# EasyEDA Pro project TC264D核心板.epro

# Schematic TC264D核心板 copy
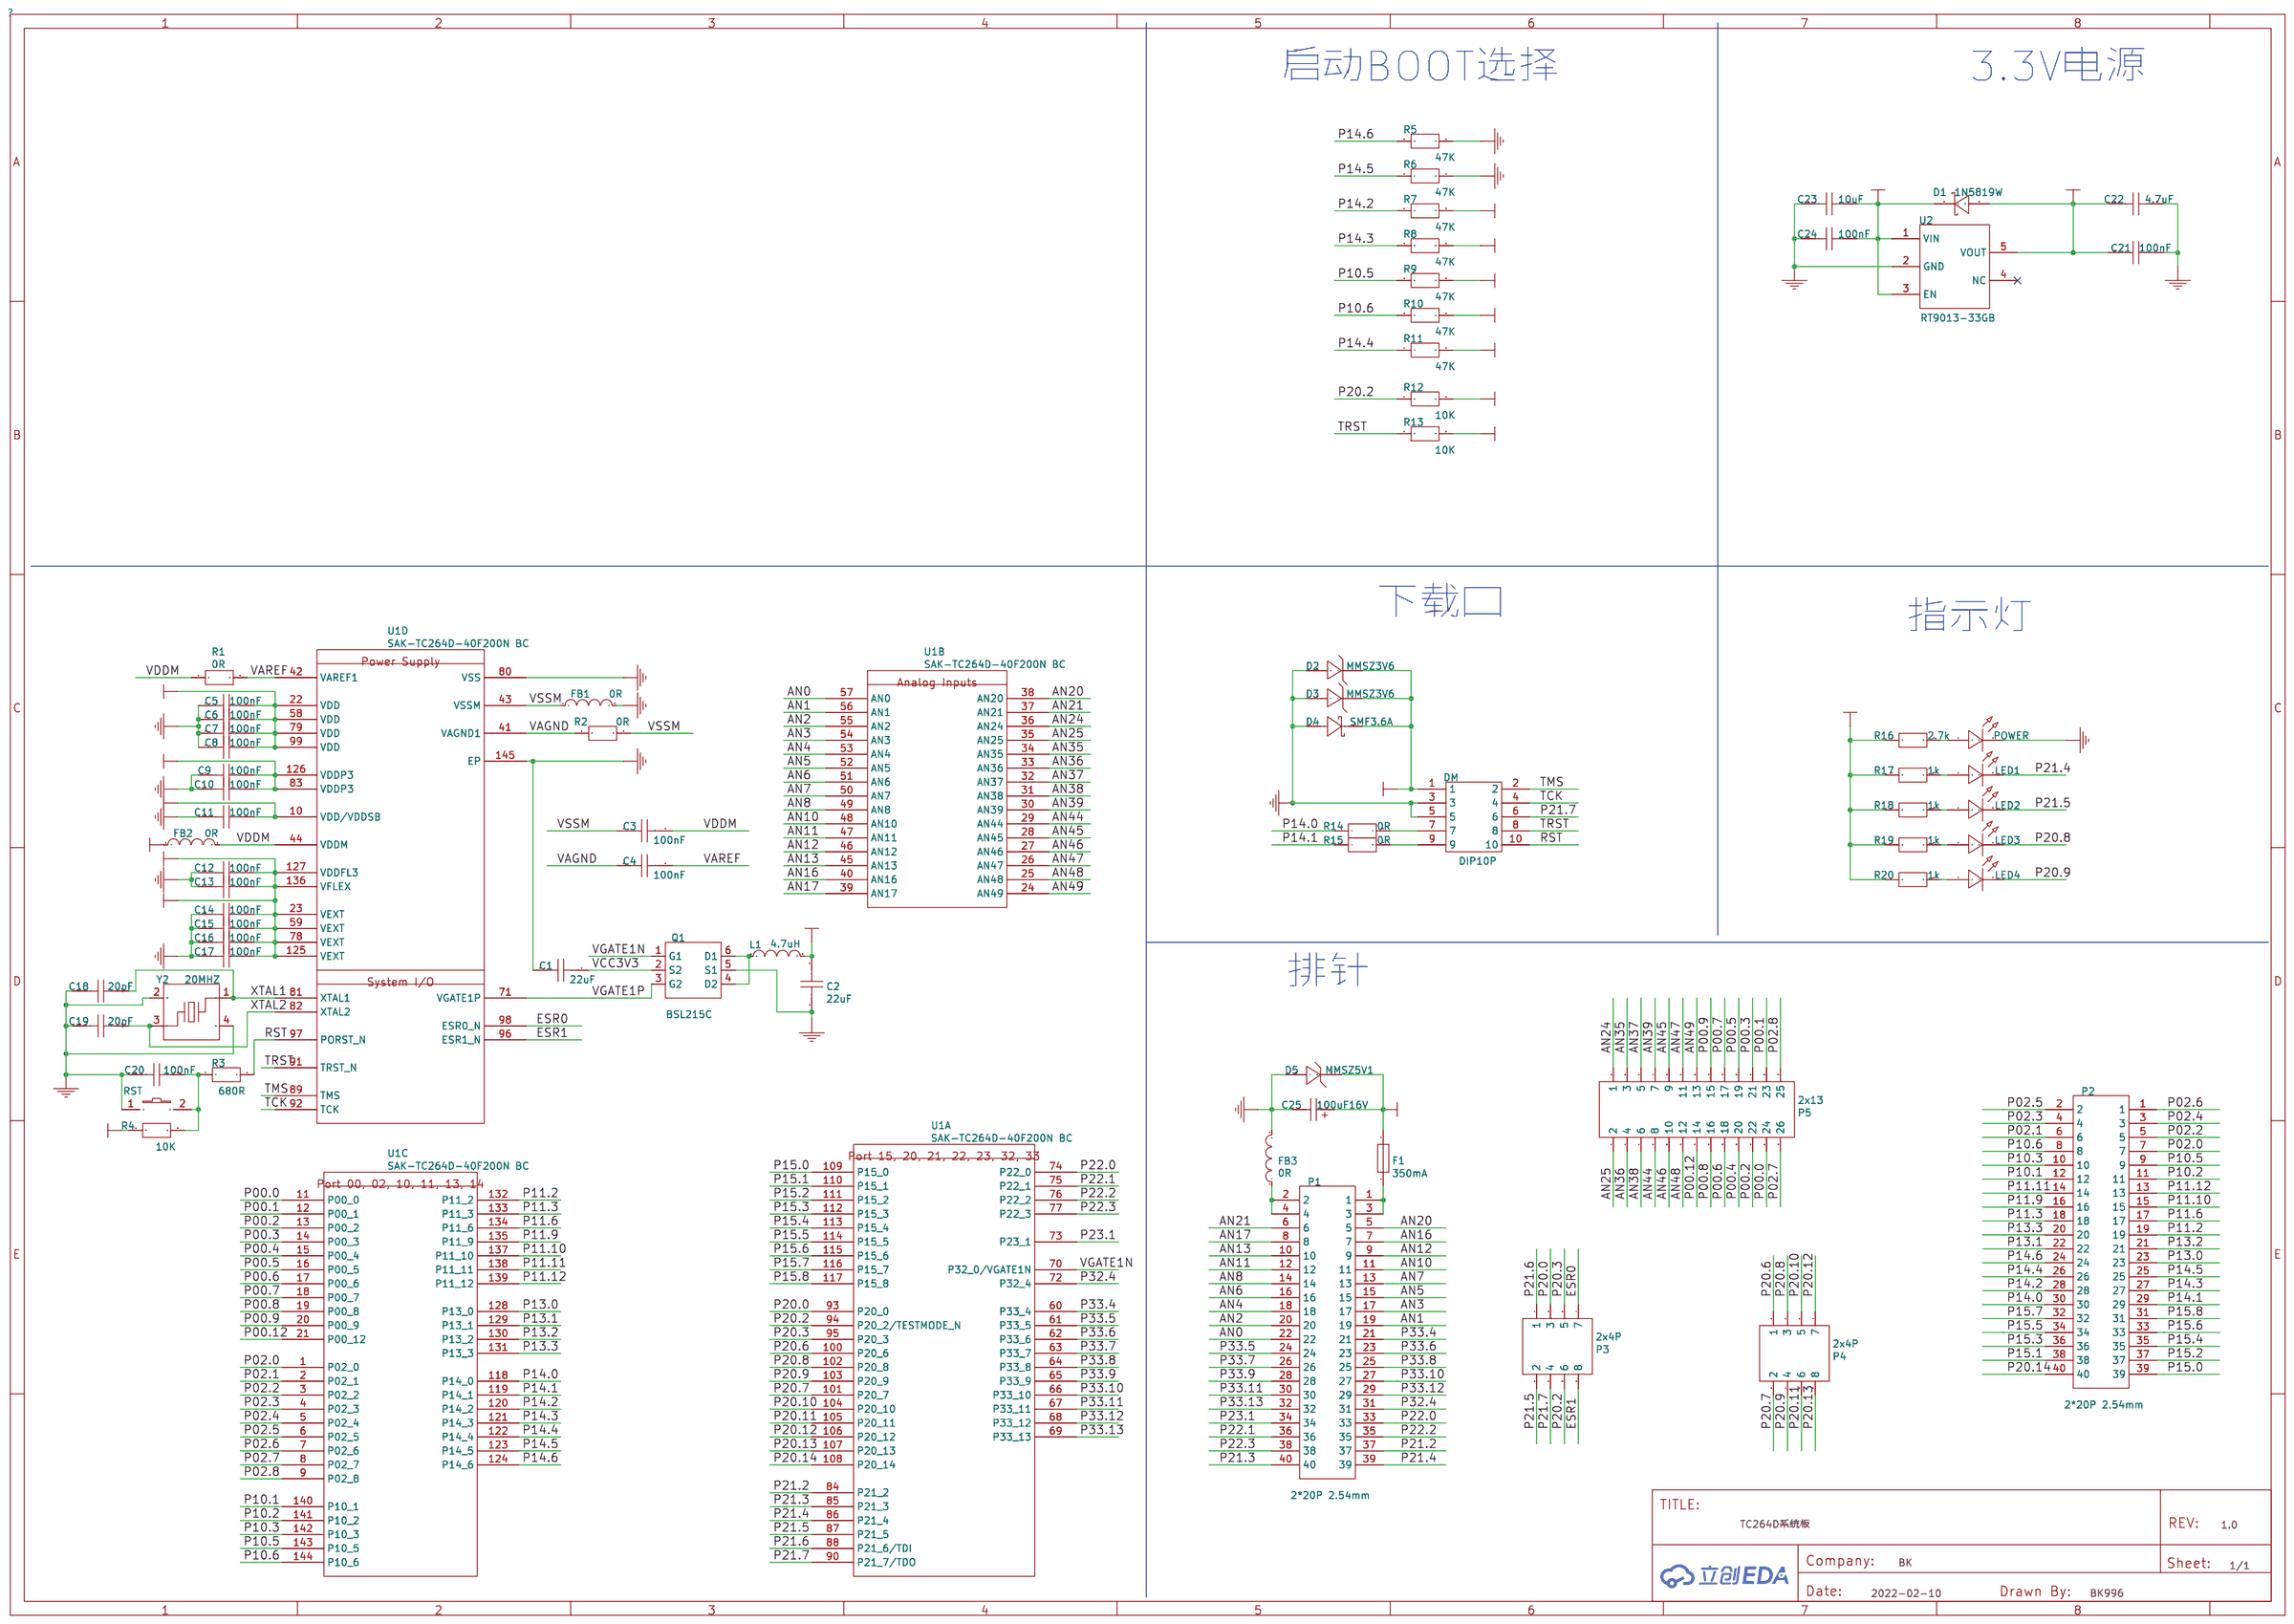
[diagram p0: schematic sheet]

## Parts
C1  22uF  [C0603]
C2  22uF  [C0603]
C3  100nF  [C0603]
C4  100nF  [C0603]
C5  100nF  [C0603]
C6  100nF  [C0603]
C7  100nF  [C0603]
C8  100nF  [C0603]
C9  100nF  [C0603]
C10  100nF  [C0603]
C11  100nF  [C0603]
C12  100nF  [C0603]
C13  100nF  [C0603]
C14  100nF  [C0603]
C15  100nF  [C0603]
C16  100nF  [C0603]
C17  100nF  [C0603]
C18  20pF  [C0603]
C19  20pF  [C0603]
C20  100nF  [C0603]
C21  100nF  [C0603]
C22  4.7uF  [C0603]
C23  10uF  [C0603]
C24  100nF  [C0603]
C25  100uF16V  [CAP-SMD_L7.3-W4.3-R-RD]
D1  1N5819W  [SOD-123F_L2.8-W1.8-LS3.7-RD]
D2  MMSZ3V6  [SOD-123_L2.6-W1.6-LS3.5-RD]
D3  MMSZ3V6  [SOD-123_L2.6-W1.6-LS3.5-RD]
D4  SMF3.6A  [SMF_L2.8-W1.8-LS3.7-FD-1]
D5  MMSZ5V1  [SOD-123_L2.7-W1.6-LS3.7-RD]
DM  DIP10P  [DIP-2X5P-2.54MM-JN]
F1  350mA  [F1206]
FB1  0R  [FB0603]
FB2  0R  [FB0603]
FB3  0R  [FB0603]
L1  4.7uH  [IND-SMD_L7.3-W6.6_MHCI06030]
LED1  LED-0603_G  [LED0603_GREEN]
LED2  LED-0603_G  [LED0603_GREEN]
LED3  LED-0603_G  [LED0603_GREEN]
LED4  LED-0603_G  [LED0603_GREEN]
P1  2*20P 2.54mm  [HDR-TH_40P-P2.54-V-F-R2-C20-S2.54]
P2  2*20P 2.54mm  [HDR-TH_40P-P2.54-V-F-R2-C20-S2.54]
P3  2x4P  [HDR-TH_8P-P2.54-V-M-R2-C4-S2.54]
P4  2x4P  [HDR-TH_8P-P2.54-V-M-R2-C4-S2.54]
P5  2x13  [HDR-TH_26P-P2.54-V-F-R2-C13-S2.54-1]
POWER  LED-0603_R  [LED0603_RED]
Q1  BSL215C  [TSOP-6_L3.0-W1.5-P0.95-LS2.8-BL]
R1  0R  [R0805]
R2  0R  [R0805]
R3  680R  [R0603]
R4  10K  [R0603]
R5  47K  [R0603]
R6  47K  [R0603]
R7  47K  [R0603]
R8  47K  [R0603]
R9  47K  [R0603]
R10  47K  [R0603]
R11  47K  [R0603]
R12  10K  [R0603]
R13  10K  [R0603]
R14  0R  [R0603]
R15  0R  [R0603]
R16  2.7k  [R0603]
R17  1k  [R0603]
R18  1k  [R0603]
R19  1k  [R0603]
R20  1k  [R0603]
RST  K2-3.6×6.1_SMD  [3*6*2.5MM轻触开关]
U1  SAK-TC264D-40F200N BC  [QFP50P2200X2200X160-145N-1]  (sections 1,2,3,4)
U2  RT9013-33GB  [SOT-23-5_L3.0-W1.7-P0.95-LS2.8-BR]
Y2  20MHZ  [CRYSTAL-SMD_4P-L3.2-W2.5-BL]

## Library data of the parts
C1 C2 = 22uF
C3-C17 C20 C21 C24 = 100nF
C18 C19 = 20pF
C22 = 4.7uF
C23 = 10uF
C25 = CA45-D-16V-100UF-K: Supplier: LCSC; Manufacturer: CEC; Supplier Part: C129274; JLCPCB Part Class: Extended Part
D1 = 1N5819W: Supplier: LCSC; Supplier Part: C169540; Manufacturer: Shandong Jingdao Microelectronics; JLCPCB Part Class: Extended Part
D2 D3 = MMSZ3V6CW: Supplier: LCSC; Supplier Part: C248749; Manufacturer: Tak Cheong; JLCPCB Part Class: Extended Part
D4 = SMF8V5A-E3-18: Supplier: LCSC; Supplier Part: C1977927; Manufacturer: VISHAY(威世); JLCPCB Part Class: Extended Part
D5 = MMSZ5V1T1G: Supplier: LCSC; Supplier Part: C132283; Manufacturer: ON Semicon; JLCPCB Part Class: Extended Part
DM = Z-2310118161010: Supplier: LCSC; Manufacturer: ZHENGLING; Supplier Part: C130109
F1 = FSMD012-1206-R: Supplier: LCSC; Supplier Part: C220144; Manufacturer: Fuzetec Tech; JLCPCB Part Class: Extended Part
FB1-FB3 = PZ2012U121-1R0TF: Supplier: LCSC; Supplier Part: C370081; Manufacturer: Sunlord; JLCPCB Part Class: Extended Part
L1 = MHCI06030-4R7M-R8: Supplier: LCSC; Manufacturer: Chilisin; Supplier Part: C108295; JLCPCB Part Class: Extended Part
LED1-LED4 = 19-217/GHC-YR1S2/3T: Manufacturer: EVERLIGHT(台湾亿光); Supplier Part: C72043; Supplier: LCSC
P1 P2 = -: Supplier: LCSC; Supplier Part: C169819; Manufacturer: Shenzhen Cankemeng; JLCPCB Part Class: Extended Part
P3 P4 = Header2X4P 2.54mm: Supplier: LCSC; Manufacturer: ReliaPro; Supplier Part: C58363; JLCPCB Part Class: Extended Part
P5 = 2×13Female header Straight line: Supplier: LCSC; Manufacturer: BOOMELE; Supplier Part: C64320; JLCPCB Part Class: Extended Part
POWER = 19-217/R6C-AL1M2VY/3T: Manufacturer: EVERLIGHT(台湾亿光); Supplier Part: C72044; Supplier: LCSC
Q1 = BSL215CH6327XTSA1: Supplier: LCSC; Manufacturer: Infineon; Supplier Part: C150914; JLCPCB Part Class: Extend
R1 R2 R14 R15 = 0R
R3 = 680R
R4 R12 R13 = 10K
R5-R11 = 47K
R16 = 2.7k
R17-R20 = 1k
RST = K2-1107ST-A4SW-06: Supplier Part: C118141; Supplier: LCSC; 制造商: 韩国韩荣
U1 = SAK-TC264D-40F200N BC: PackageReference: PG-LQFP-144-22; Manufacturer: Infineon Technologies
U2 = RT9013-33GB: Supplier: LCSC; Manufacturer: RICHTEK; Supplier Part: C47773; JLCPCB Part Class: Extended Part
Y2 = smd-3225-8Mhz: Supplier: LCSC; Supplier Part: C9900005479; Manufacturer: null; JLCPCB Part Class: Extended Part

## Nets
GNDCORE: C1.1 C2.1 C5.1 C6.1 C7.1 C8.1 C9.1 C10.1 C11.1 C12.1 C13.1 C14.1 C15.1 C16.1 C17.1 C18.1 C19.1 C20.1 C21.2 C22.2 C23.1 C24.1 C25.2 D2.2(A) D3.2(A) D4.1(A) D5.2(A) DM.3 DM.5 FB1.2 FB3.2 POWER.2 Q1.5(S1) R5.2 R6.2 RST.1 U1.80(VSS) U1.145(EP) U2.2(GND) Y2.2(GND) Y2.4(GND)
VCC: C23.2 C24.2 C25.1 D1.1 D5.1(C) F1.2 U2.1(VIN) U2.3(EN)
VCC1V3: C2.2 C5.2 C6.2 C7.2 C8.2 C11.2 L1.2 U1.10(VDD/VDDSB) U1.22(VDD) U1.58(VDD) U1.79(VDD) U1.99(VDD)
VCC3V3: C1.2 C9.2 C10.2 C12.2 C13.2 C14.2 C15.2 C16.2 C17.2 C21.1 C22.1 D1.2 D2.1(K) D3.1(K) D4.2(K) DM.1 FB2.1 Q1.2(S2) R4.1 R7.2 R8.2 R9.2 R10.2 R11.2 R12.2 R13.2 R16.1 R17.1 R18.1 R19.1 R20.1 U1.23(VEXT) U1.59(VEXT) U1.78(VEXT) U1.83(VDDP3) U1.125(VEXT) U1.126(VDDP3) U1.127(VDDFL3) U1.136(VFLEX) U2.5(VOUT)
VDDM: C3.2 FB2.2 R1.1 U1.44(VDDM)
VSSM: C3.1 FB1.1 R2.2 U1.43(VSSM)
AN0: P1.22 U1.57(AN0)
AN1: P1.19 U1.56(AN1)
AN2: P1.20 U1.55(AN2)
AN3: P1.17 U1.54(AN3)
AN4: P1.18 U1.53(AN4)
AN5: P1.15 U1.52(AN5)
AN6: P1.16 U1.51(AN6)
AN7: P1.13 U1.50(AN7)
AN8: P1.14 U1.49(AN8)
AN10: P1.11 U1.48(AN10)
AN11: P1.12 U1.47(AN11)
AN12: P1.9 U1.46(AN12)
AN13: P1.10 U1.45(AN13)
AN16: P1.7 U1.40(AN16)
AN17: P1.8 U1.39(AN17)
AN20: P1.5 U1.38(AN20)
AN21: P1.6 U1.37(AN21)
AN24: P5.1 U1.36(AN24)
AN25: P5.2 U1.35(AN25)
AN35: P5.3 U1.34(AN35)
AN36: P5.4 U1.33(AN36)
AN37: P5.5 U1.32(AN37)
AN38: P5.6 U1.31(AN38)
AN39: P5.7 U1.30(AN39)
AN44: P5.8 U1.29(AN44)
AN45: P5.9 U1.28(AN45)
AN46: P5.10 U1.27(AN46)
AN47: P5.11 U1.26(AN47)
AN48: P5.12 U1.25(AN48)
AN49: P5.13 U1.24(AN49)
ESR0: P3.7 U1.98(ESR0_N)
ESR1: P3.8 U1.96(ESR1_N)
P00.0: P5.24 U1.11(P00_0)
P00.1: P5.23 U1.12(P00_1)
P00.2: P5.22 U1.13(P00_2)
P00.3: P5.21 U1.14(P00_3)
P00.4: P5.20 U1.15(P00_4)
P00.5: P5.19 U1.16(P00_5)
P00.6: P5.18 U1.17(P00_6)
P00.7: P5.17 U1.18(P00_7)
P00.8: P5.16 U1.19(P00_8)
P00.9: P5.15 U1.20(P00_9)
P00.12: P5.14 U1.21(P00_12)
P02.0: P2.7 U1.1(P02_0)
P02.1: P2.6 U1.2(P02_1)
P02.2: P2.5 U1.3(P02_2)
P02.3: P2.4 U1.4(P02_3)
P02.4: P2.3 U1.5(P02_4)
P02.5: P2.2 U1.6(P02_5)
P02.6: P2.1 U1.7(P02_6)
P02.7: P5.26 U1.8(P02_7)
P02.8: P5.25 U1.9(P02_8)
P10.1: P2.12 U1.140(P10_1)
P10.2: P2.11 U1.141(P10_2)
P10.3: P2.10 U1.142(P10_3)
P10.5: P2.9 R9.1 U1.143(P10_5)
P10.6: P2.8 R10.1 U1.144(P10_6)
P11.2: P2.19 U1.132(P11_2)
P11.3: P2.18 U1.133(P11_3)
P11.6: P2.17 U1.134(P11_6)
P11.9: P2.16 U1.135(P11_9)
P11.10: P2.15 U1.137(P11_10)
P11.11: P2.14 U1.138(P11_11)
P11.12: P2.13 U1.139(P11_12)
P13.0: P2.23 U1.128(P13_0)
P13.1: P2.22 U1.129(P13_1)
P13.2: P2.21 U1.130(P13_2)
P13.3: P2.20 U1.131(P13_3)
P14.0: P2.30 R14.1 U1.118(P14_0)
P14.1: P2.29 R15.1 U1.119(P14_1)
P14.2: P2.28 R7.1 U1.120(P14_2)
P14.3: P2.27 R8.1 U1.121(P14_3)
P14.4: P2.26 R11.1 U1.122(P14_4)
P14.5: P2.25 R6.1 U1.123(P14_5)
P14.6: P2.24 R5.1 U1.124(P14_6)
P15.0: P2.39 U1.109(P15_0)
P15.1: P2.38 U1.110(P15_1)
P15.2: P2.37 U1.111(P15_2)
P15.3: P2.36 U1.112(P15_3)
P15.4: P2.35 U1.113(P15_4)
P15.5: P2.34 U1.114(P15_5)
P15.6: P2.33 U1.115(P15_6)
P15.7: P2.32 U1.116(P15_7)
P15.8: P2.31 U1.117(P15_8)
P20.0: P3.3 U1.93(P20_0)
P20.2: P3.6 R12.1 U1.94(P20_2/TESTMODE_N)
P20.3: P3.5 U1.95(P20_3)
P20.6: P4.1 U1.100(P20_6)
P20.7: P4.2 U1.101(P20_7)
P20.8: LED3.2 P4.3 U1.102(P20_8)
P20.9: LED4.2 P4.4 U1.103(P20_9)
P20.10: P4.5 U1.104(P20_10)
P20.11: P4.6 U1.105(P20_11)
P20.12: P4.7 U1.106(P20_12)
P20.13: P4.8 U1.107(P20_13)
P20.14: P2.40 U1.108(P20_14)
P21.2: P1.37 U1.84(P21_2)
P21.3: P1.40 U1.85(P21_3)
P21.4: LED1.2 P1.39 U1.86(P21_4)
P21.5: LED2.2 P3.2 U1.87(P21_5)
P21.6: P3.1 U1.88(P21_6/TDI)
P21.7: DM.6 P3.4 U1.90(P21_7/TDO)
P22.0: P1.33 U1.74(P22_0)
P22.1: P1.36 U1.75(P22_1)
P22.2: P1.35 U1.76(P22_2)
P22.3: P1.38 U1.77(P22_3)
P23.1: P1.34 U1.73(P23_1)
P32.4: P1.31 U1.72(P32_4)
P33.4: P1.21 U1.60(P33_4)
P33.5: P1.24 U1.61(P33_5)
P33.6: P1.23 U1.62(P33_6)
P33.7: P1.26 U1.63(P33_7)
P33.8: P1.25 U1.64(P33_8)
P33.9: P1.28 U1.65(P33_9)
P33.10: P1.27 U1.66(P33_10)
P33.11: P1.30 U1.67(P33_11)
P33.12: P1.29 U1.68(P33_12)
P33.13: P1.32 U1.69(P33_13)
RST: DM.10 R3.2 U1.97(PORST_N)
TCK: DM.4 U1.92(TCK)
TMS: DM.2 U1.89(TMS)
TRST: DM.8 R13.1 U1.91(TRST_N)
VAGND: C4.1 R2.1 U1.41(VAGND1)
VAREF: C4.2 R1.2 U1.42(VAREF1)
VGATE1N: Q1.1(G1) U1.70(P32_0/VGATE1N)
VGATE1P: Q1.3(G2) U1.71(VGATE1P)
XTAL1: C18.2 U1.81(XTAL1) Y2.1
XTAL2: C19.2 U1.82(XTAL2) Y2.3
DM_7: DM.7 R14.2
DM_9: DM.9 R15.2
P1_1: F1.1 P1.1 P1.3
P1_2: FB3.1 P1.2 P1.4
Q1_4: L1.1 Q1.4(D2) Q1.6(D1)
R3_1: C20.2 R3.1 R4.2 RST.2
R16_2: POWER.1 R16.2
R17_2: LED1.1 R17.2
R18_2: LED2.1 R18.2
R19_2: LED3.1 R19.2
R20_2: LED4.1 R20.2

Not connected (* = marked no-connect by the designer): U2 4(NC)*

## Notes on the sheet
- 启动BOOT选择
- 3.3V电源
- 下载口
- 指示灯
- 排针

# Board TC264D系统板_bk copy
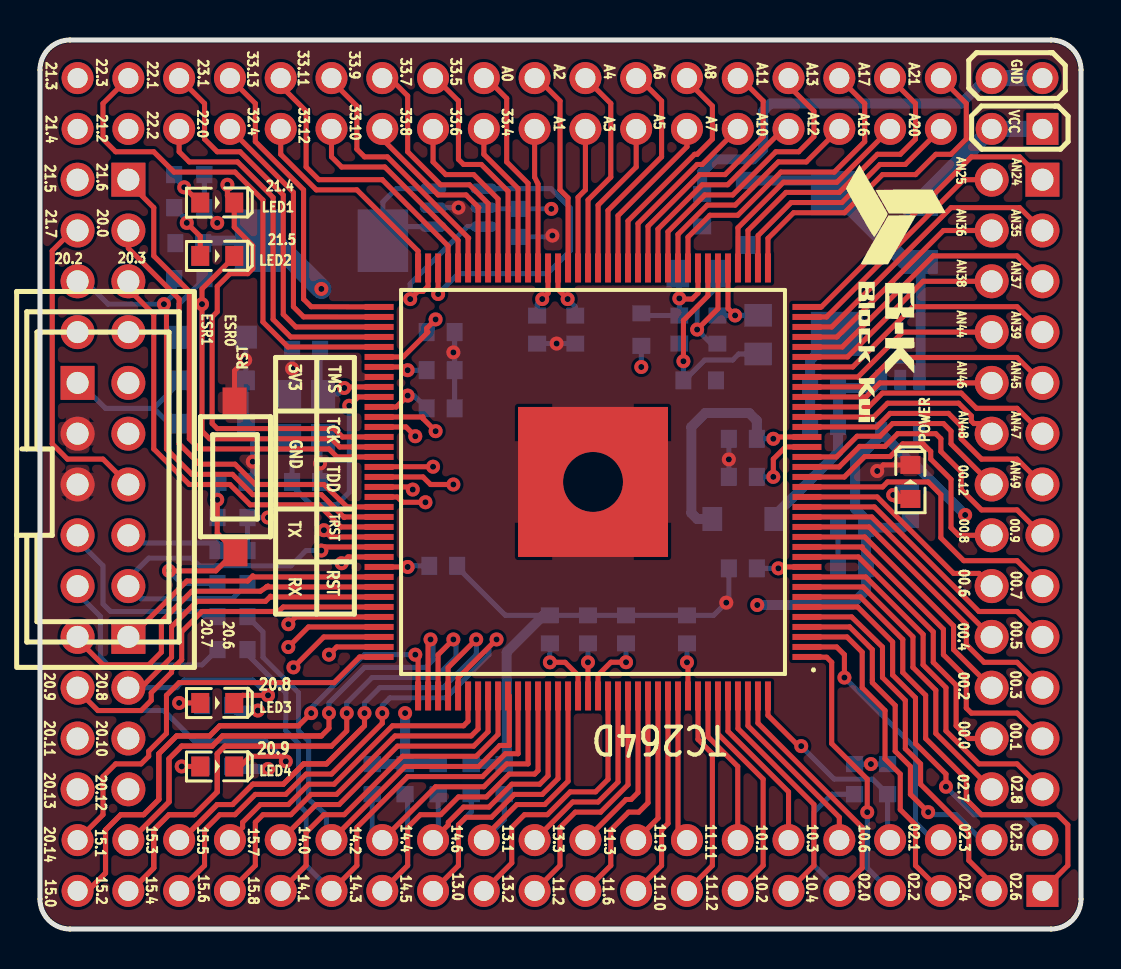
[diagram p1: board, top side]
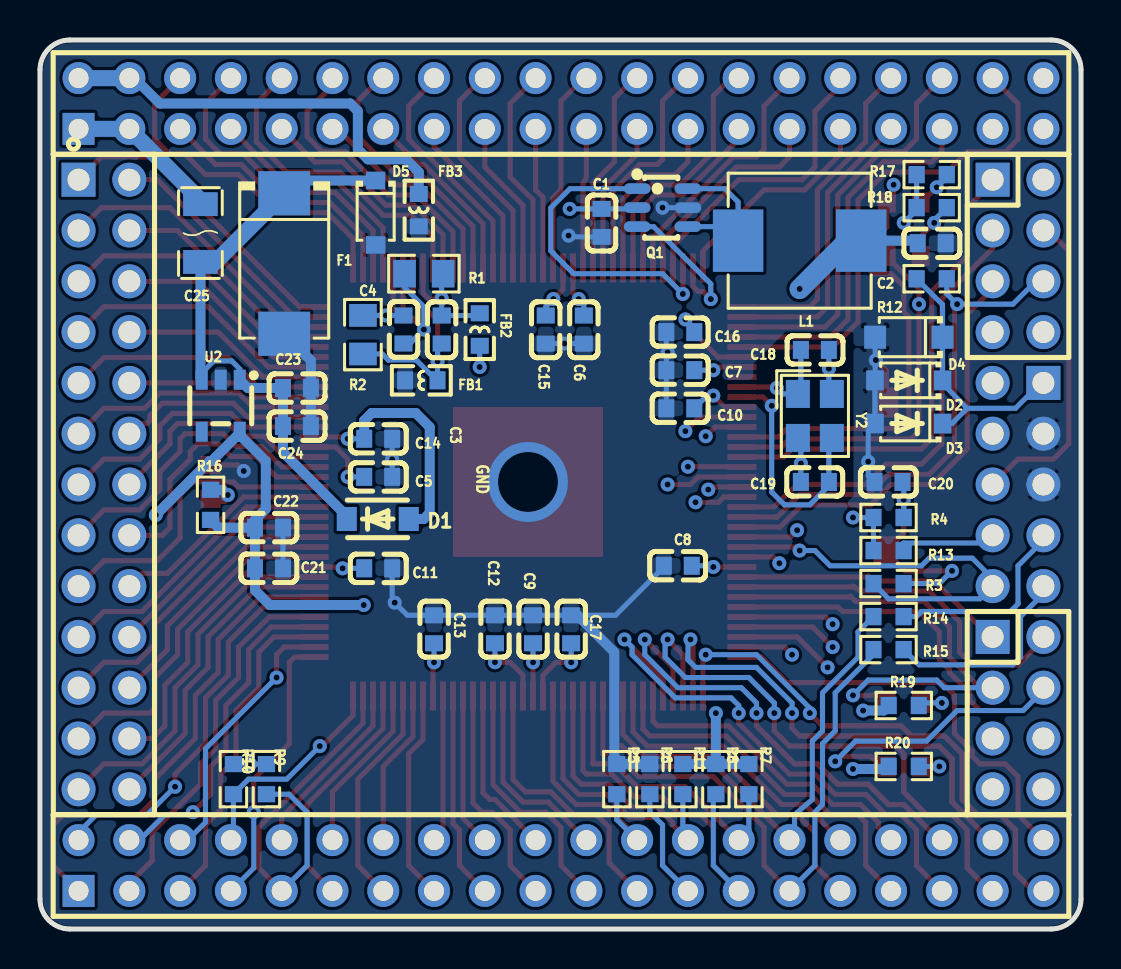
[diagram p2: board, bottom side, seen from below]

Outline 52.07 x 44.45 mm; copper layers: Top Layer, Inner1, Inner2, Bottom Layer. Coordinates in mm from the lower left corner of the outline.
Outline path: 0,42.95 arc(0.44,44.01) 1.5,44.45 50.57,44.45 arc(51.63,44.01) 52.07,42.95 52.07,1.5 arc(51.63,0.44) 50.57,0 1.5,0 arc(0.44,0.44) 0,1.5 0,42.95
Stack: Top Layer 0.035mm / Dielectric1 0.48mm PP er 4.5 / Inner1 0.035mm / Dielectric2 0.48mm FR4 er 4.5 / Inner2 0.035mm / Dielectric3 0.48mm PP er 4.5 / Bottom Layer 0.035mm

## Design rules (mm)
spacing safeClearance (default): track to track 0.152, other pairs 0.152 to 0.3
track width trackWidth (default): min 0.127, default 0.254, max 2.54
differential pair differentialPair (default): width min 0.127, default 0.254, max 2.54; gap min 0.152, default 0.152
via viaSize (default): diameter min 0.5, default 0.61, max 10; hole min 0.3, default 0.305, max 6
pour e331 uses gge18794
pour e332 uses gge23207
pour e385 uses gge21965
pour e386 uses gge23651
pour e481 uses gge23591
pour e1359 uses gge23309

## Placement (name value [footprint] x y rotation side)
C1  22uF  [C0603]  23.98 35.31 90 bottom
C2  22uF  [C0603]  7.47 34.29 0 bottom
C3  100nF  [C0603]  31.98 29.97 90 bottom
C4  100nF  [C0603]  33.88 29.97 270 bottom
C5  100nF  [C0603]  35.16 22.61 0 bottom
C6  100nF  [C0603]  26.77 29.97 90 bottom
C7  100nF  [C0603]  20.04 27.94 180 bottom
C8  100nF  [C0603]  20.17 18.16 180 bottom
C9  100nF  [C0603]  27.41 14.99 270 bottom
C10  100nF  [C0603]  20.04 26.03 180 bottom
C11  100nF  [C0603]  35.16 18.03 0 bottom
C12  100nF  [C0603]  29.31 14.99 270 bottom
C13  100nF  [C0603]  32.36 14.99 270 bottom
C14  100nF  [C0603]  35.16 24.51 0 bottom
C15  100nF  [C0603]  24.87 29.97 90 bottom
C16  100nF  [C0603]  20.04 29.84 180 bottom
C17  100nF  [C0603]  25.5 14.99 270 bottom
C18  20pF  [C0603]  13.31 28.96 0 bottom
C19  20pF  [C0603]  13.31 22.35 180 bottom
C20  100nF  [C0603]  9.63 22.35 180 bottom
C21  100nF  [C0603]  40.62 18.03 180 bottom
C22  4.7uF  [C0603]  40.62 20.07 180 bottom
C23  10uF  [C0603]  39.22 27.05 0 bottom
C24  100nF  [C0603]  39.22 25.15 0 bottom
C25  100uF16V  [CAP-SMD_L7.3-W4.3-R-RD]  39.85 33.27 90 bottom
D1  1N5819W  [SOD-123F_L2.8-W1.8-LS3.7-RD]  35.18 20.5 180 bottom
D2  MMSZ3V6  [SOD-123_L2.6-W1.6-LS3.5-RD]  8.61 27.43 0 bottom
D3  MMSZ3V6  [SOD-123_L2.6-W1.6-LS3.5-RD]  8.61 25.27 0 bottom
D4  SMF3.6A  [SMF_L2.8-W1.8-LS3.7-FD-1]  8.61 29.59 180 bottom
D5  MMSZ5V1  [SOD-123_L2.7-W1.6-LS3.7-RD]  35.28 35.81 270 bottom
DM  DIP10P  [DIP-2X5P-2.54MM-JN]  3.15 18.42 270 top
F1  350mA  [F1206]  44.04 34.8 270 bottom
FB1  0R  [FB0603]  33 27.43 0 bottom
FB2  0R  [FB0603]  30.07 29.97 90 bottom
FB3  0R  [FB0603]  33.12 35.94 270 bottom
L1  4.7uH  [IND-SMD_L7.3-W6.6_MHCI06030]  14.07 34.42 180 bottom
LED1  LED-0603_G  [LED0603_GREEN]  8.87 36.32 0 top
LED2  LED-0603_G  [LED0603_GREEN]  8.87 33.65 0 top
LED3  LED-0603_G  [LED0603_GREEN]  8.87 11.3 0 top
LED4  LED-0603_G  [LED0603_GREEN]  8.87 8.13 0 top
P1  2*20P 2.54mm  [HDR-TH_40P-P2.54-V-F-R2-C20-S2.54]  26.01 41.28 180 bottom
P2  2*20P 2.54mm  [HDR-TH_40P-P2.54-V-F-R2-C20-S2.54]  26.01 3.17 180 bottom
P3  2x4P  [HDR-TH_8P-P2.54-V-M-R2-C4-S2.54]  3.15 33.66 270 bottom
P4  2x4P  [HDR-TH_8P-P2.54-V-M-R2-C4-S2.54]  3.15 10.8 270 bottom
P5  2x13  [HDR-TH_26P-P2.54-V-F-R2-C13-S2.54-1]  48.87 22.22 270 bottom
POWER  LED-0603_R  [LED0603_RED]  43.54 22.35 90 top
Q1  BSL215C  [TSOP-6_L3.0-W1.5-P0.95-LS2.8-BL]  20.93 36.07 270 bottom
R1  0R  [R0805]  32.87 32.77 0 bottom
R2  0R  [R0805]  35.92 29.72 270 bottom
R3  680R  [R0603]  9.63 17.27 0 bottom
R4  10K  [R0603]  9.63 20.57 180 bottom
R5  47K  [R0603]  23.22 7.49 90 bottom
R6  47K  [R0603]  21.57 7.49 90 bottom
R7  47K  [R0603]  16.61 7.49 90 bottom
R8  47K  [R0603]  18.26 7.49 90 bottom
R9  47K  [R0603]  40.74 7.49 90 bottom
R10  47K  [R0603]  42.39 7.49 90 bottom
R11  47K  [R0603]  19.91 7.49 90 bottom
R12  10K  [R0603]  7.47 32.51 0 bottom
R13  10K  [R0603]  9.63 18.92 0 bottom
R14  0R  [R0603]  9.63 15.62 180 bottom
R15  0R  [R0603]  9.63 13.97 180 bottom
R16  2.7k  [R0603]  43.54 21.21 90 bottom
R17  1k  [R0603]  7.47 37.72 180 bottom
R18  1k  [R0603]  7.47 36.07 180 bottom
R19  1k  [R0603]  8.87 11.18 180 bottom
R20  1k  [R0603]  8.87 8.13 180 bottom
RST  K2-3.6×6.1_SMD  [3*6*2.5MM轻触开关]  9.75 22.61 270 top
U1  SAK-TC264D-40F200N BC  [QFP50P2200X2200X160-145N-1]  27.66 22.35 180 top
U2  RT9013-33GB  [SOT-23-5_L3.0-W1.7-P0.95-LS2.8-BR]  43.03 26.16 90 bottom
Y2  20MHZ  [CRYSTAL-SMD_4P-L3.2-W2.5-BL]  13.31 25.65 270 bottom

## Footprints (pads in the part's own frame, mm; a bottom-side part is the same pattern mirrored in y, then rotated)
3*6*2.5MM轻触开关
  custom 1.5x1.2 smd: 1(-3.72,-0.021) 2(3.72,0.021)
C0603
  rect 0.8x0.9 smd: 1(-0.7,0) 2(0.7,0)
CAP-SMD_L7.3-W4.3-R-RD
  rect 2.208x2.592 smd: 1(3.511,0) 2(-3.511,0)
CRYSTAL-SMD_4P-L3.2-W2.5-BL
  rect 1.4x1.2 smd: 1(-1.1,-0.85) 2(1.1,-0.85) 3(1.1,0.85) 4(-1.1,0.85)
DIP-2X5P-2.54MM-JN
  rect 1.7x1.7 hole 1.1: 1(-8.89,-1.27)
  round 1.7 hole 1.1: 2(-8.89,1.27) 3(-6.35,-1.27) 4(-6.35,1.27) 5(-3.81,-1.27) 6(-3.81,1.27) 7(-1.27,-1.27) 8(-1.27,1.27) 9(1.27,-1.27) 10(1.27,1.27)
F1206
  rect 1.19x1.728 smd: 1(-1.445,0) 2(1.445,0)
FB0603
  rect 0.8x0.9 smd: 1(-0.813,0) 2(0.813,0)
HDR-TH_8P-P2.54-V-M-R2-C4-S2.54
  rect 1.7x1.7 hole 1.1: 1(-3.81,-1.27)
  round 1.7 hole 1.1: 2(-3.81,1.27) 3(-1.27,-1.27) 4(-1.27,1.27) 5(1.27,-1.27) 6(1.27,1.27) 7(3.81,-1.27) 8(3.81,1.27)
HDR-TH_26P-P2.54-V-F-R2-C13-S2.54-1
  rect 1.7x1.7 hole 1.1: 1(-15.24,-1.27)
  round 1.7 hole 1.1: 2(-15.24,1.27) 3(-12.7,-1.27) 4(-12.7,1.27) 5(-10.16,-1.27) 6(-10.16,1.27) 7(-7.62,-1.27) 8(-7.62,1.27) 9(-5.08,-1.27) 10(-5.08,1.27) 11(-2.54,-1.27) 12(-2.54,1.27) 13(0,-1.27) 14(0,1.27) 15(2.54,-1.27) 16(2.54,1.27) 17(5.08,-1.27) 18(5.08,1.27) 19(7.62,-1.27) 20(7.62,1.27) 21(10.16,-1.27) 22(10.16,1.27) 23(12.7,-1.27) 24(12.7,1.27) 25(15.24,-1.27) 26(15.24,1.27)
HDR-TH_40P-P2.54-V-F-R2-C20-S2.54
  rect 1.6x1.6 hole 1: 1(-24.13,-1.27)
  round 1.6 hole 1: 2(-24.13,1.27) 3(-21.59,-1.27) 4(-21.59,1.27) 5(-19.05,-1.27) 6(-19.05,1.27) 7(-16.51,-1.27) 8(-16.51,1.27) 9(-13.97,-1.27) 10(-13.97,1.27) 11(-11.43,-1.27) 12(-11.43,1.27) 13(-8.89,-1.27) 14(-8.89,1.27) 15(-6.35,-1.27) 16(-6.35,1.27) 17(-3.81,-1.27) 18(-3.81,1.27) 19(-1.27,-1.27) 20(-1.27,1.27) 21(1.27,-1.27) 22(1.27,1.27) 23(3.81,-1.27) 24(3.81,1.27) 25(6.35,-1.27) 26(6.35,1.27) 27(8.89,-1.27) 28(8.89,1.27) 29(11.43,-1.27) 30(11.43,1.27) 31(13.97,-1.27) 32(13.97,1.27) 33(16.51,-1.27) 34(16.51,1.27) 35(19.05,-1.27) 36(19.05,1.27) 37(21.59,-1.27) 38(21.59,1.27) 39(24.13,-1.27) 40(24.13,1.27)
IND-SMD_L7.3-W6.6_MHCI06030
  rect 2.524x3.12 smd: 1(-3.078,0) 2(3.078,0)
LED0603_GREEN
  rect 0.9x1 smd: 1(-0.85,0) 2(0.85,0)
LED0603_RED
  rect 0.9x1 smd: 1(-0.85,0) 2(0.85,0)
QFP50P2200X2200X160-145N-1
  rect 1.45x0.3 smd: 1(-10.7,8.75) 2(-10.7,8.25) 3(-10.7,7.75) 4(-10.7,7.25) 5(-10.7,6.75) 6(-10.7,6.25) 7(-10.7,5.75) 8(-10.7,5.25) 9(-10.7,4.75) 10(-10.7,4.25) 11(-10.7,3.75) 12(-10.7,3.25) 13(-10.7,2.75) 14(-10.7,2.25) 15(-10.7,1.75) 16(-10.7,1.25) 17(-10.7,0.75) 18(-10.7,0.25) 19(-10.7,-0.25) 20(-10.7,-0.75) 21(-10.7,-1.25) 22(-10.7,-1.75) 23(-10.7,-2.25) 24(-10.7,-2.75) 25(-10.7,-3.25) 26(-10.7,-3.75) 27(-10.7,-4.25) 28(-10.7,-4.75) 29(-10.7,-5.25) 30(-10.7,-5.75) 31(-10.7,-6.25) 32(-10.7,-6.75) 33(-10.7,-7.25) 34(-10.7,-7.75) 35(-10.7,-8.25) 36(-10.7,-8.75) 73(10.7,-8.75) 74(10.7,-8.25) 75(10.7,-7.75) 76(10.7,-7.25) 77(10.7,-6.75) 78(10.7,-6.25) 79(10.7,-5.75) 80(10.7,-5.25) 81(10.7,-4.75) 82(10.7,-4.25) 83(10.7,-3.75) 84(10.7,-3.25) 85(10.7,-2.75) 86(10.7,-2.25) 87(10.7,-1.75) 88(10.7,-1.25) 89(10.7,-0.75) 90(10.7,-0.25) 91(10.7,0.25) 92(10.7,0.75) 93(10.7,1.25) 94(10.7,1.75) 95(10.7,2.25) 96(10.7,2.75) 97(10.7,3.25) 98(10.7,3.75) 99(10.7,4.25) 100(10.7,4.75) 101(10.7,5.25) 102(10.7,5.75) 103(10.7,6.25) 104(10.7,6.75) 105(10.7,7.25) 106(10.7,7.75) 107(10.7,8.25) 108(10.7,8.75)
  rect 0.3x1.45 smd: 37(-8.75,-10.7) 38(-8.25,-10.7) 39(-7.75,-10.7) 40(-7.25,-10.7) 41(-6.75,-10.7) 42(-6.25,-10.7) 43(-5.75,-10.7) 44(-5.25,-10.7) 45(-4.75,-10.7) 46(-4.25,-10.7) 47(-3.75,-10.7) 48(-3.25,-10.7) 49(-2.75,-10.7) 50(-2.25,-10.7) 51(-1.75,-10.7) 52(-1.25,-10.7) 53(-0.75,-10.7) 54(-0.25,-10.7) 55(0.25,-10.7) 56(0.75,-10.7) 57(1.25,-10.7) 58(1.75,-10.7) 59(2.25,-10.7) 60(2.75,-10.7) 61(3.25,-10.7) 62(3.75,-10.7) 63(4.25,-10.7) 64(4.75,-10.7) 65(5.25,-10.7) 66(5.75,-10.7) 67(6.25,-10.7) 68(6.75,-10.7) 69(7.25,-10.7) 70(7.75,-10.7) 71(8.25,-10.7) 72(8.75,-10.7) 109(8.75,10.7) 110(8.25,10.7) 111(7.75,10.7) 112(7.25,10.7) 113(6.75,10.7) 114(6.25,10.7) 115(5.75,10.7) 116(5.25,10.7) 117(4.75,10.7) 118(4.25,10.7) 119(3.75,10.7) 120(3.25,10.7) 121(2.75,10.7) 122(2.25,10.7) 123(1.75,10.7) 124(1.25,10.7) 125(0.75,10.7) 126(0.25,10.7) 127(-0.25,10.7) 128(-0.75,10.7) 129(-1.25,10.7) 130(-1.75,10.7) 131(-2.25,10.7) 132(-2.75,10.7) 133(-3.25,10.7) 134(-3.75,10.7) 135(-4.25,10.7) 136(-4.75,10.7) 137(-5.25,10.7) 138(-5.75,10.7) 139(-6.25,10.7) 140(-6.75,10.7) 141(-7.25,10.7) 142(-7.75,10.7) 143(-8.25,10.7) 144(-8.75,10.7)
  rect 7.5x7.5 smd: 145(0,0)
R0603
  rect 0.806x0.864 smd: 1(-0.753,0) 2(0.753,0)
R0805
  rect 1.133x1.377 smd: 1(-0.966,0) 2(0.966,0)
SMF_L2.8-W1.8-LS3.7-FD-1
  rect 1.1x1.15 smd: 1(-1.685,0) 2(1.685,0)
SOD-123_L2.6-W1.6-LS3.5-RD
  rect 0.88x0.99 smd: 1(-1.692,0) 2(1.692,0)
SOD-123_L2.7-W1.6-LS3.7-RD
  rect 0.88x0.96 smd: 1(-1.61,0) 2(1.61,0)
SOD-123F_L2.8-W1.8-LS3.7-RD
  rect 1x1.2 smd: 1(-1.55,0) 2(1.55,0)
SOT-23-5_L3.0-W1.7-P0.95-LS2.8-BR
  rect 1x0.6 smd: 1(1.3,-0.95) 2(1.3,0) 3(1.3,0.95) 4(-1.3,0.95) 5(-1.3,-0.95)
TSOP-6_L3.0-W1.5-P0.95-LS2.8-BL
  oval 0.532x1.336 smd: 1(-0.95,-1.268) 2(0,-1.268) 3(0.95,-1.268) 4(0.95,1.268) 5(0,1.268) 6(-0.95,1.268)

## Nets
As in the schematic.

Pads without a net: U2 4

## Via types
v1: diameter 0.7, hole 0.305, Top Layer to Bottom Layer, 83 vias
v2: diameter 4, hole 3, Top Layer to Bottom Layer, 1 via

## Routing (per net, layer and track width the routed paths; a pad name or vN(x,y) marks a point on that pad's centre or on a via; arc(x,y) is an arc through that point)
GNDCORE: length 61.6
  Top Layer w0.254: RST.1 9.73,27.92 v1(10.26,28.45) ; POWER.2 42.18,23.2 v1(41.88,22.9)
  Bottom Layer w0.254: C16.1 20.74,28.89 v1(20.68,28.83) 20.74,28.76 C10.1 ; Y2.2 14.01,24.4 v1(14.01,23.28) C19.1 ; Y2.4 12.61,26.9 v1(12.61,28.02) C18.1 ; C8.1 20.87,18.1 23.28,15.69 C17.1 C13.1 33.7,15.69 v1(34.33,16.32) 34.46,16.44 C11.1 ; D4.1 D2.2 D3.2 10.64,24.93 v1(10.64,23.37) 10.64,22.67 10.33,22.35 ; C5.1 v1(34.46,23.48) C14.1 ; C22.2 C21.2 ; C15.1 v1(25.84,29.27) C6.1 ; v1(25.63,34.67) 25.56,34.61 C1.1 ; Q1.5 v1(20.93,36.07)
  Bottom Layer w0.5: 22.43,8.25 23.34,8.25 23.34,13.84 25.19,15.69 25.5,15.69 ; C25.2 38.52,28.43 C23.1 C24.1 ; R6.2 R5.2
  vias: v2(27.66,22.35)
VCC: length 29.8
  Bottom Layer w0.254: U2.1 42.08,28 42.48,28.4 43.38,28.4 43.98,27.8 U2.3
  Bottom Layer w0.5: C25.1 39.22,37.42 D5.1 ; D1.1 36.73,20.65 39.92,23.84 39.92,27.05 41.67,27.05 U2.1 ; U2.3 44.04,27.53 44.04,33.35
  Bottom Layer w0.8: 44.04,33.35 43.29,33.35 C25.1
VCC1V3: length 80.1
  Top Layer w0.254: v1(26.39,31.5) 25.91,31.98 U1.58 ; v1(36.68,22.61) 36.68,23.5 37.29,24.1 U1.22 ; U1.10 37,18.1 v1(36.93,18.03) ; U1.99 v1(18.39,18.1) ; U1.79 18.23,28.1 v1(18.39,27.94)
  Inner1 w0.254: v1(36.68,22.61) 36.68,18.29 v1(36.93,18.03)
  Inner1 w0.5: v1(14.07,32) 14.33,32 v1(18.39,27.94) ; v1(36.93,18.03) 36.68,18.29 v1(36.68,22.61) 36.57,22.5 33.48,22.5 28.04,27.94 v1(18.39,27.94) ; v1(18.39,27.94) 19.24,27.94 21.48,25.7 21.48,20 19.58,18.1 v1(18.39,18.1) ; v1(18.39,27.94) 20.65,30.2 25.58,30.2 26.39,31.02 v1(26.39,31.5)
  Bottom Layer w0.254: v1(18.39,18.1) 18.45,18.16 19.47,18.16 ; v1(26.39,31.5) 26.77,31.11 C6.2 ; C7.2 v1(18.39,27.94) ; C11.2 v1(36.93,18.03) ; C5.2 v1(36.68,22.61)
  Bottom Layer w0.5: L1.2 8.3,34.42 8.17,34.29
  Bottom Layer w1.016: v1(14.07,32) 11.66,34.42 L1.2
VCC3V3: length 92.4
  Top Layer w0.254: v1(32.36,13.33) 32.41,13.28 U1.136 ; 29.31,13.34 28.55,13.34 27.91,12.7 U1.127 ; 19.41,29.84 18.16,28.6 U1.78 ; U1.59 25.41,31.79 v1(25.12,31.5) ; v1(36.68,24.51) 36.77,24.6 U1.23 ; U1.125 26.91,12.69 26.26,13.33 v1(25.5,13.33) ; v1(19.79,30.48) 19.34,30.03 C16.2 ; U1.83 17.82,26.1 v1(18.39,26.67) ; v1(27.41,13.33) U1.126
  Bottom Layer w0.254: v1(8.87,35.31) 8.22,35.95 R18.1 R17.1 ; C12.2 29.31,13.21 ; C9.2 v1(27.41,13.33) ; C10.2 18.71,26.67 v1(18.39,26.67) ; 5.69,26.03 3.28,26.03 2.01,27.31 DM.1 ; 5.69,26.03 6.92,27.26 D2.1 D4.2 6.93,31.22 R12.2 ; 5.69,26.03 6.45,25.27 D3.1 ; v1(25.58,36.01) C1.2 22.01,36.01 21.95,36.07 ; FB2.1 v1(30.08,28.1) ; R10.2 v1(41.56,8.25) R9.2 ; v1(11.41,20.57) R4.1 R13.2 ; C17.2 v1(25.5,13.33) ; C16.2 19.34,30.03 v1(19.79,30.48) ; v1(25.12,31.5) 24.87,31.24 C15.2 ; C13.2 v1(32.36,13.33) ; C14.2 v1(36.68,24.51)
  Bottom Layer w0.5: v1(11.41,8) 9.75,8 R20.1 ; R8.2 v1(18.26,10.8) ; C14.2 35.85,25.42 35.48,25.8 33.28,25.8 32.58,25.1 32.58,20.8 32.88,20.5 D1.2 ; R7.2 R11.2 ; v1(46.28,20.7) 43.58,23.4 43.48,23.4 42.08,24.8 U2.5 42.08,24.7 40.78,23.4 40.78,21 41.32,20.46 C22.1 ; C22.1 43.15,20.07 R16.1 ; C22.1 C21.1 41.32,16.94 40.58,16.2 v1(35.88,16.2) ; R19.1 9.87,10.92 v1(10.9,10.92)
  vias: v1(29.31,13.34)
VDDM: length 6.4
  Top Layer w0.254: U1.44 32.91,31.79 32.62,31.5 32.01,31.5 v1(31.98,31.53)
  Bottom Layer w0.254: FB2.2 30.19,30.67 C3.2 v1(31.98,31.53) 31.98,32.69 R1.1
VSSM: length 11.4
  Top Layer w0.254: v1(32.18,28.39) 32.18,30.43 33.41,31.66 U1.43
  Bottom Layer w0.254: C3.1 32.18,29.07 v1(32.18,28.39) FB1.1 32.23,27.43 33.25,28.45 34.65,28.45 34.95,28.75 R2.2
AN0: length 10.3
  Top Layer w0.254: U1.57 26.41,36.56 26.01,36.96 26.01,41.4 24.87,42.55 P1.22
AN1: length 7.1
  Top Layer w0.254: U1.56 26.91,36.59 27.28,36.96 27.28,40
AN2: length 10.5
  Top Layer w0.254: U1.55 27.41,36.45 28.55,37.59 28.55,41.28 P1.20
AN3: length 7.6
  Top Layer w0.254: 27.92,33.15 27.92,36.19 29.82,38.1 29.82,40
AN4: length 11.2
  Top Layer w0.254: P1.18 29.95,42.55 31.09,41.4 31.09,38.61 28.41,35.93 U1.53
AN5: length 8.4
  Top Layer w0.254: 32.36,40 32.36,39.12 28.91,35.67 U1.52
AN6: length 11.8
  Top Layer w0.254: U1.51 29.41,35.41 32.74,38.73 32.87,38.73 33.63,39.5 33.63,41.15 32.36,42.42 P1.16
AN7: length 9.2
  Top Layer w0.254: 34.9,40 33.12,38.23 32.87,38.23 29.91,35.27 U1.50
AN8: length 13.2
  Top Layer w0.254: P1.14 35.03,42.55 36.17,41.4 36.17,39.62 34.27,37.72 33,37.72 30.41,35.14 U1.49
AN10: length 10.5
  Top Layer w0.254: 30.91,33.05 30.91,35 33.12,37.21 34.39,37.21 37.19,40 37.44,40
AN11: length 14.5
  Top Layer w0.254: P1.12 37.44,42.16 38.71,40.89 38.71,39.62 37.95,38.86 36.81,38.86 34.65,36.7 33.25,36.7 31.41,34.86 U1.47
AN12: length 11.9
  Top Layer w0.254: U1.46 31.91,34.73 33.38,36.19 34.77,36.19 36.93,38.35 38.33,38.35 39.98,40
AN13: length 16.1
  Top Layer w0.254: U1.45 32.41,34.59 33.5,35.69 34.9,35.69 37.06,37.85 39.73,37.85 41.25,39.37 41.25,41.28 P1.10
AN16: length 11.7
  Top Layer w0.254: 42.52,40 39.85,37.34 37.19,37.34 34.91,35.06 U1.40
AN17: length 15.7
  Top Layer w0.254: U1.39 35.41,34.93 37.31,36.83 39.98,36.83 41.89,38.73 43.03,38.73 43.79,39.5 43.79,41.28 P1.8
AN20: length 13
  Top Layer w0.254: U1.38 35.92,34.67 37.57,36.32 40.11,36.32 42.01,38.23 43.28,38.23 45.06,40
AN21: length 17
  Top Layer w0.254: U1.37 36.41,34.53 37.69,35.81 40.23,35.81 42.14,37.72 43.79,37.72 44.81,38.73 45.57,38.73 46.33,39.5 46.33,41.28 P1.6
AN24: length 15.4
  Top Layer w0.254: U1.36 39.08,31.1 46.59,38.61 49,38.61 50.14,37.47
AN25: length 12.1
  Top Layer w0.254: 38.36,30.6 39.34,30.6 46.2,37.47 P5.2
AN35: length 14.7
  Top Layer w0.254: 50.14,34.92 49,36.07 45.57,36.07 39.6,30.1 38.36,30.1
AN36: length 11.4
  Top Layer w0.254: 38.36,29.6 39.86,29.6 45.19,34.92 P5.4
AN37: length 14.2
  Top Layer w0.254: 38.36,29.1 40.13,29.1 44.68,33.66 48.87,33.66 50.14,32.39
AN38: length 10.8
  Top Layer w0.254: P5.6 44.17,32.39 40.39,28.6 38.36,28.6
AN39: length 13.6
  Top Layer w0.254: 50.14,29.84 48.87,31.11 43.66,31.11 40.65,28.1 38.36,28.1
AN44: length 10.2
  Top Layer w0.254: P5.8 43.16,29.84 40.91,27.6 38.36,27.6
AN45: length 12.9
  Top Layer w0.254: 50.14,27.31 48.87,28.58 42.65,28.58 41.18,27.1 38.36,27.1
AN46: length 9.5
  Top Layer w0.254: P5.10 42.01,27.31 41.31,26.6 38.36,26.6
AN47: length 12.9
  Top Layer w0.254: U1.26 41.44,26.1 42.14,26.8 46.08,26.8 46.84,26.03 48.87,26.03 50.14,24.77
AN48: length 10.3
  Top Layer w0.254: P5.12 47.09,25.27 46.71,25.27 46.59,25.4 46.59,25.65 45.95,26.29 42.39,26.29 41.71,25.6 38.36,25.6
AN49: length 13.9
  Top Layer w0.254: 50.14,22.22 48.87,23.5 47.09,23.5 46.08,24.51 46.08,25.15 45.44,25.78 42.52,25.78 41.84,25.1 U1.24
DM_7: length 9.9
  Bottom Layer w0.254: DM.7 1.88,19.43 3.15,18.16 3.15,16.26 3.53,15.88 7.98,15.88 8.23,15.62 R14.2
DM_9: length 10.4
  Bottom Layer w0.254: R15.2 8.1,13.21 3.41,13.21 3.02,13.59 3.02,15.62 1.88,16.76 1.88,17.14
ESR0: length 19.8
  Top Layer w0.254: U1.98 15.4,18.6 v1(15.09,18.29)
  Inner2 w0.254: v1(15.09,18.29) 15.6,18.8 15.6,20.45 12.68,23.37 12.68,24 6.83,29.84 P3.7
ESR1: length 19.9
  Top Layer w0.254: v1(14.2,19.94) 14.54,19.6 U1.96
  Inner2 w0.254: v1(14.2,19.94) 14.2,20.95 6.45,28.7 3.02,28.7 P3.8
P00.0: length 15.1
  Top Layer w0.254: P5.24 46.46,9.53 45.82,10.16 45.82,12.19 44.68,13.33 44.68,14.86 40.94,18.6 U1.11
P00.1: length 17.4
  Top Layer w0.254: U1.12 41.12,19.1 41.12,19.05 45.19,14.99 45.19,13.72 46.33,12.57 46.33,11.05 46.59,10.8 48.87,10.8 50.14,9.53
P00.2: length 13.1
  Top Layer w0.254: P5.22 45.7,13.97 45.7,15.16 41.25,19.6 38.36,19.6
P00.3: length 15.7
  Top Layer w0.254: 38.36,20.1 41.47,20.1 46.33,15.24 46.33,14.22 47.22,13.33 48.87,13.33 50.14,12.06
P00.4: length 11.7
  Top Layer w0.254: P5.20 41.6,20.6 38.36,20.6
P00.5: length 14.5
  Top Layer w0.254: 50.14,14.61 48.87,15.88 46.97,15.88 41.74,21.1 38.36,21.1
P00.6: length 11.1
  Top Layer w0.254: 38.36,21.6 41.87,21.6 45.7,17.78 46.97,17.78 P5.18
P00.7: length 15.3
  Top Layer w0.254: 50.14,17.14 48.87,18.42 46.2,18.42 45.06,19.56 45.06,21.72 44.43,22.35 42.39,22.35 42.15,22.1 38.36,22.1
P00.8: length 13.5
  Top Layer w0.254: P5.16 45.95,19.69 45.57,20.07 45.57,22.48 44.55,23.5 44.55,23.88 44.17,24.26 43.16,24.26 42.52,23.62 41.25,23.62 40.23,22.6 38.36,22.6
P00.9: length 15.5
  Top Layer w0.254: 38.36,23.1 39.97,23.1 41,24.13 42.27,24.13 42.9,24.77 44.81,24.77 45.06,24.51 45.06,23.88 46.08,22.86 46.08,21.97 47.09,20.95 48.87,20.95 50.14,19.69
P00.12: length 11.6
  Top Layer w0.254: P5.14 45.57,24.26 45.57,24.89 45.19,25.27 42.65,25.27 42.01,24.64 40.87,24.64 39.83,23.6 U1.21
P1_1: length 7.8
  Bottom Layer w0.8: F1.1 44.04,36.45 47.6,40 50.14,40
P1_2: length 21
  Bottom Layer w0.5: 36.17,39.37 36.17,40.89 36.55,41.28 46.08,41.28 47.35,42.55 P1.4 ; 36.17,39.24 36.17,38.99 35.66,38.48 33.76,38.48 33.12,37.85 FB3.1
  Bottom Layer w0.8: P1.2 P1.4
P02.0: length 14
  Top Layer w0.254: 38.36,13.6 39.35,13.59 39.6,13.33 39.6,9.27 41.38,7.49 v1(41.38,5.84)
  Bottom Layer w0.254: P2.7 41.38,3.05 v1(41.38,5.84)
P02.1: length 13.5
  Top Layer w0.254: U1.2 39.85,14.1 40.23,13.72 v1(40.23,12.57)
  Bottom Layer w0.254: v1(40.23,12.57) 43.79,9.02 43.79,5.33 44.68,4.44 P2.6
P02.2: length 16.6
  Top Layer w0.254: P2.5 43.79,3.17 43.79,5.21 43.03,5.97 43.03,7.75 42.27,8.51 42.27,10.92 41.12,12.06 41.12,13.84 40.37,14.6 U1.3
P02.3: length 16.8
  Top Layer w0.254: v1(44.43,5.84) 43.54,6.73 43.54,8.13 42.78,8.89 42.78,11.18 41.63,12.32 41.63,13.97 40.5,15.1 U1.4
  Bottom Layer w0.254: v1(44.43,5.84) 44.55,5.72 45.82,5.72 47.09,4.44 P2.4
P02.4: length 18.8
  Top Layer w0.254: 38.36,15.6 40.6,15.6 42.14,14.1 42.14,12.57 43.28,11.43 43.28,9.02 44.04,8.25 44.04,7.24 46.46,4.83 46.46,3.43 47.6,2.29 P2.3
P02.5: length 19.5
  Top Layer w0.254: U1.6 40.9,16.1 42.65,14.35 42.65,12.7 43.79,11.56 43.79,9.27 45.31,7.75 v1(45.31,7.11)
  Bottom Layer w0.254: v1(45.31,7.11) 46.71,5.72 49.25,5.72 50.14,4.83 P2.2
P02.6: length 24.4
  Top Layer w0.254: P2.1 51.41,3.17 51.41,5.21 50.9,5.72 47.09,5.72 46.33,6.48 46.33,7.49 44.3,9.53 44.3,11.68 43.16,12.83 43.16,14.48 41.03,16.6 38.36,16.6
P02.7: length 15.6
  Top Layer w0.254: U1.8 41.17,17.1 43.66,14.61 43.66,13.08 44.81,11.94 44.81,9.78 P5.26
P02.8: length 18.3
  Top Layer w0.254: 50.14,6.98 48.87,8.25 46.97,8.25 45.31,9.91 45.31,12.06 44.17,13.21 44.17,14.73 41.3,17.6 U1.9
P10.1: length 8.5
  Top Layer w0.254: P2.12 37.44,6.86 34.41,9.89 U1.140
P10.2: length 11.8
  Top Layer w0.254: U1.141 34.91,10.02 38.71,6.22 38.71,3.17 P2.11
P10.3: length 9.1
  Top Layer w0.254: U1.142 35.41,10.16 39.98,5.59 P2.10
P10.5: length 19.2
  Top Layer w0.254: P2.9 41.12,3.05 41.12,5.08 35.91,10.29 U1.143
  Bottom Layer w0.254: P2.9 38.71,3.17 38.71,5.84 39.61,6.74 40.74,6.74
P10.6: length 10.9
  Top Layer w0.254: v1(38.08,9.14) 37.95,9.14 36.41,10.68 U1.144
  Bottom Layer w0.254: v1(38.08,9.14) 39.73,7.49 41.64,7.49 R10.1 42.39,4.57 P2.8
P11.2: length 11.3
  Top Layer w0.254: U1.132 30.41,6.31 29.95,5.84 29.44,5.84 28.55,4.95 28.55,3.17 P2.19
P11.3: length 7.7
  Top Layer w0.254: U1.133 30.91,5.54 P2.18
P11.6: length 10.4
  Top Layer w0.254: P2.17 31.09,3.17 31.09,4.95 31.41,5.27 U1.134
P11.9: length 7.4
  Top Layer w0.254: U1.135 31.91,4.89 P2.16
P11.10: length 10.6
  Top Layer w0.254: U1.137 32.91,9.48 33.63,8.76 33.63,3.17 P2.15
P11.11: length 7.8
  Top Layer w0.254: U1.138 33.41,9.62 34.9,8.13 P2.14
P11.12: length 11.2
  Top Layer w0.254: U1.139 33.91,9.75 36.17,7.49 36.17,3.17 P2.13
P13.0: length 13.7
  Top Layer w0.254: U1.128 28.41,7.48 27.79,6.86 26.52,6.86 25.38,5.72 24.23,5.72 23.6,5.08 23.6,3.3 P2.23
P13.1: length 9.7
  Top Layer w0.254: U1.129 28.91,7.35 27.92,6.35 26.65,6.35 P2.22
P13.2: length 12.4
  Top Layer w0.254: U1.130 29.41,7.21 28.04,5.84 26.77,5.84 26.01,5.08 26.01,3.17 P2.21
P13.3: length 8.4
  Top Layer w0.254: U1.131 29.91,6.82 29.57,6.48 29.31,6.48 P2.20
P14.0: length 26.3
  Top Layer w0.254: 23.47,11.68 23.47,9.18 23,9.18 21.95,8.13 18.26,8.13 P2.30
  Bottom Layer w0.254: P2.30 14.33,4.7 14.33,5.72 13.44,6.48 13.44,9.4 12.93,9.91 12.93,11.81 11.15,13.59 11.15,14.86 R14.1
P14.1: length 30
  Top Layer w0.254: U1.119 23.91,8.76 23.28,8.76 22.13,7.62 18.39,7.62 15.85,5.08 15.85,3.17 P2.29
  Bottom Layer w0.254: P2.29 13.31,3.17 13.31,5.84 12.93,6.22 12.93,9.27 12.29,9.91 12.29,11.81 10.38,13.72 R15.1
P14.2: length 14.8
  Top Layer w0.254: P2.28 19.79,7.11 22.2,7.11 23.34,8.25 24.41,8.25 24.41,11.65
  Bottom Layer w0.254: R7.1 16.61,4.95 P2.28
P14.3: length 20.6
  Top Layer w0.254: U1.121 24.91,7.92 24.74,7.75 23.47,7.75 22.33,6.6 20.93,6.6 20.04,5.72 19.03,5.72 18.39,5.08 18.39,3.17 P2.27
  Bottom Layer w0.254: P2.27 18.39,3.17 18.39,6.74 18.26,6.74
P14.4: length 13.5
  Top Layer w0.254: P2.26 20.42,5.21 20.42,5.33 21.19,6.1 22.46,6.1 23.6,7.24 25,7.24 25.41,7.66 U1.122
  Bottom Layer w0.254: R11.1 19.91,4.7 P2.26
P14.5: length 19.5
  Top Layer w0.254: P2.25 20.93,3.17 20.93,5.21 21.31,5.59 22.58,5.59 23.72,6.73 25.12,6.73 25.91,7.52 U1.123
  Bottom Layer w0.254: R6.1 21.57,5.84 20.93,5.21 20.93,3.17 P2.25
P14.6: length 12.5
  Top Layer w0.254: U1.124 26.41,7.39 25.25,6.22 23.85,6.22 22.65,5.02 22.65,4.89 P2.24
  Bottom Layer w0.254: P2.24 23.22,5.46 R5.1
P15.0: length 43.7
  Top Layer w0.254: 3.28,4.95 4.04,5.72 ; 3.28,4.95 4.04,5.72 ; 3.28,4.95 3.28,2.79 ; 3.28,4.95 3.28,2.79 ; 4.04,5.72 5.18,5.72 ; 4.04,5.72 5.18,5.72 ; 8.48,9.65 8.99,10.16 ; 8.48,9.65 6.83,9.65 ; 8.48,9.65 8.99,10.16 ; 8.48,9.65 6.83,9.65 ; 8.99,10.16 12.93,10.16 ; 8.99,10.16 12.93,10.16 ; 2.39,1.91 P2.39 2.39,1.91 ; 2.39,1.91 3.28,2.79 ; 2.39,1.91 3.28,2.79 ; 5.94,6.48 5.94,8.76 ; 5.94,6.48 5.18,5.72 ; 5.94,6.48 5.18,5.72 ; 5.94,6.48 5.94,8.76 ; 5.94,8.76 6.83,9.65 ; 5.94,8.76 6.83,9.65 ; 12.93,10.16 v1(13.56,10.8) ; v1(18.77,13.72) 18.91,13.58 U1.109
  Bottom Layer w0.254: v1(13.56,10.8) 13.56,11.05 16.23,13.72 v1(18.77,13.72)
P15.1: length 38
  Top Layer w0.254: 4.55,4.44 6.45,6.35 ; 4.55,4.44 P2.38 4.55,4.44 ; 4.55,4.44 6.45,6.35 ; 6.45,6.35 6.45,8.51 ; 6.45,6.35 6.45,8.51 ; 14.07,9.65 9.12,9.65 ; 14.07,9.65 9.12,9.65 ; 14.07,9.65 14.45,10.03 v1(14.45,10.8) ; 6.45,8.51 7.09,9.14 ; 6.45,8.51 7.09,9.14 ; 9.12,9.65 8.61,9.14 ; 9.12,9.65 8.61,9.14 ; v1(19.53,14.48) 19.41,14.36 U1.110 ; 8.61,9.14 7.09,9.14 ; 8.61,9.14 7.09,9.14
  Bottom Layer w0.254: v1(14.45,10.8) 14.45,11.3 16.23,13.08 19.28,13.08 19.66,13.46 19.66,14.35 v1(19.53,14.48)
P15.2: length 43.7
  Top Layer w0.254: 7.72,5.72 8.87,6.86 ; 7.72,5.72 6.45,5.72 ; 7.72,5.72 8.87,6.86 ; 7.72,5.72 6.45,5.72 ; 8.87,6.86 8.87,8.76 ; 8.87,6.86 8.87,8.76 ; 8.87,8.76 9.25,9.14 ; 8.87,8.76 9.25,9.14 ; 6.45,5.72 5.69,4.95 ; 6.45,5.72 5.69,4.95 ; 9.25,9.14 14.58,9.14 ; 9.25,9.14 14.58,9.14 ; 5.69,3.05 5.69,4.95 ; 5.69,3.05 5.69,4.95 ; 5.69,3.05 4.55,1.91 ; 5.69,3.05 4.55,1.91 ; 4.55,1.91 P2.37 4.55,1.91 ; 14.58,9.14 15.34,9.91 v1(15.34,10.8) ; v1(20.68,14.48) 19.91,13.71 U1.111
  Bottom Layer w0.254: v1(15.34,10.8) 15.34,11.3 16.61,12.57 19.79,12.57 20.8,13.59 20.8,14.35 v1(20.68,14.48)
P15.3: length 35
  Top Layer w0.254: 12.17,7.24 13.18,8.25 ; 12.17,7.24 13.18,8.25 ; 12.17,7.24 10.64,7.24 ; 12.17,7.24 10.64,7.24 ; 13.18,8.25 14.33,8.25 ; 13.18,8.25 14.33,8.25 ; 8.87,6.22 9.63,6.22 ; 8.87,6.22 9.63,6.22 ; 8.87,6.22 7.09,4.44 ; 8.87,6.22 7.09,4.44 ; 9.63,6.22 10.64,7.24 ; 9.63,6.22 10.64,7.24 ; 7.09,4.44 P2.36 7.09,4.44 ; 14.33,8.25 16.1,10.03 ; 14.33,8.25 16.23,10.16 v1(16.23,10.8) ; v1(21.82,14.48) 20.41,13.07 U1.112
  Bottom Layer w0.254: v1(16.23,10.8) 16.23,11.3 16.99,12.06 20.17,12.06 21.82,13.72 v1(21.82,14.48)
P15.4: length 26.5
  Top Layer w0.254: v1(17.12,10.8) 17.12,10.29 14.58,7.75 13.31,7.75 12.29,6.73 10.77,6.73 9.75,5.72 8.99,5.72 8.23,4.95 8.23,3.17 P2.35 ; v1(22.84,14.48) 20.91,12.55 U1.113
  Bottom Layer w0.254: v1(22.84,14.48) 22.46,14.1 22.46,13.72 20.3,11.56 17.5,11.56 17.12,11.18 v1(17.12,10.8)
P15.5: length 15.8
  Top Layer w0.254: U1.114 21.41,10.39 21.19,10.16 17.63,10.16 14.71,7.24 13.44,7.24 12.42,6.22 11.03,6.22 10.14,5.33 10.14,5.08 P2.34
P15.6: length 18.7
  Top Layer w0.254: P2.33 10.77,3.17 10.77,5.33 11.15,5.72 12.55,5.72 13.56,6.73 14.84,6.73 17.76,9.65 21.57,9.65 21.91,10 U1.115
P15.7: length 14.4
  Top Layer w0.254: P2.32 13.82,6.22 14.96,6.22 17.88,9.14 21.69,9.14 22.41,9.86 U1.116
P15.8: length 17
  Top Layer w0.254: P2.31 13.31,3.17 13.31,4.83 14.2,5.72 15.22,5.72 18.14,8.64 21.82,8.64 22.91,9.73 U1.117
P20.0: length 23
  Top Layer w0.254: 16.96,21.1 15.36,21.1 14.2,22.22 10.77,22.22 9.75,23.24 7.98,23.24 6.96,24.26 6.96,31.5 4.42,34.04 P3.3
P20.2: length 25.7
  Top Layer w0.254: U1.94 15.24,20.6 15.22,20.57 14.07,21.72 10.64,21.72 9.63,22.73 7.6,22.73 6.33,24 6.33,31.24 v1(6.2,31.24)
  Bottom Layer w0.254: P3.6 2.26,32.39 3.41,31.24 v1(6.2,31.24) 6.72,31.76 R12.1
P20.3: length 21.8
  Top Layer w0.254: P3.5 4.42,32 5.69,30.73 5.69,24 7.47,22.22 9.5,22.22 10.52,21.21 13.95,21.21 15.05,20.1 16.96,20.1
P20.6: length 13.8
  Top Layer w0.254: U1.100 10.69,17.6 10.64,17.65 10.39,17.4 7.34,17.4 4.55,14.61 P4.1
P20.7: length 18.4
  Top Layer w0.254: U1.101 11.32,17.1 11.41,17.14 11.03,16.89 7.6,16.89 6.07,15.37 6.07,13.84 5.44,13.21 3.15,13.21 1.88,14.48 P4.2
P20.8: length 24.6
  Top Layer w0.254: U1.102 11.57,16.6 11.53,16.64 11.28,16.38 7.85,16.38 6.58,15.11 6.58,13.59 5.06,12.06 P4.3 ; 9.72,11.3 9.75,11.3 10.14,11.68 v1(11.41,11.68)
  Bottom Layer w0.254: P4.3 6.83,12.06 7.22,12.45 10.64,12.45 v1(11.41,11.68)
P20.9: length 33.8
  Top Layer w0.254: P4.4 1.88,11.94 2.9,10.92 5.06,10.92 5.56,11.43 5.56,11.81 6.58,12.83 6.58,12.95 7.09,13.46 7.09,14.86 8.1,15.88 11.91,15.88 12.17,16.1 16.96,16.1 ; LED4.2 10.01,8.13 10.52,8.64 12.04,8.64 v1(12.29,8.38)
  Bottom Layer w0.254: P4.4 1.88,11.94 2.9,10.92 6.2,10.92 7.72,9.4 11.28,9.4 v1(12.29,8.38)
P20.10: length 15.3
  Top Layer w0.254: v1(12.42,15.24) 12.78,15.6 U1.104
  Inner1 w0.254: P4.5 4.42,9.91 9.75,15.24 v1(12.42,15.24)
P20.11: length 18.4
  Top Layer w0.254: v1(12.42,14.1) 13.43,15.1 U1.105
  Inner1 w0.254: v1(12.42,14.1) 11.53,14.1 5.69,8.25 3.15,8.25 P4.6
P20.12: length 16.9
  Top Layer w0.254: v1(12.68,13.08) 14.2,14.6 U1.106
  Inner1 w0.254: v1(12.68,13.08) 11.41,13.08 8.36,10.03 8.36,8 7.47,7.11 4.55,7.11 P4.7
P20.13: length 19.5
  Top Layer w0.254: U1.107 14.84,14.1 v1(14.45,13.72)
  Inner1 w0.254: v1(14.45,13.72) 14.45,13.08 7.09,5.72 3.15,5.72 P4.8
P20.14: length 21.3
  Top Layer w0.254: 16.96,13.6 15.99,13.6 14.71,12.32 6.96,12.32 6.33,11.68 6.33,9.78 5.44,8.89 5.44,8.64 5.06,8.25 3.79,8.25 3.15,7.62 3.15,5.72 P2.40
P21.2: length 32.3
  Top Layer w0.254: U1.84 19.15,25.6 19.15,25.53 v1(19.79,24.89)
  Inner1 w0.254: v1(19.79,24.89) 19.79,24.26 19.53,24 18.26,24 17.63,24.64 15.72,24.64 14.07,26.29 14.07,28.32 10.26,32.13 10.26,37.47 9.63,38.1 9.25,38.1 8.23,39.12 8.23,40.77 7.72,41.28 5.56,41.28 4.42,40.13 4.42,40
P21.3: length 32.9
  Top Layer w0.254: U1.85 18.31,25.1 v1(18.77,24.64)
  Inner1 w0.254: v1(18.77,24.64) 16.99,26.42 16.99,26.8 10.77,33.02 10.77,40.51 10.01,41.28 8.74,41.28 8.1,41.91 8.1,43.31 7.6,43.81 3.02,43.81 1.88,42.67 P1.40
P21.4: length 31.1
  Top Layer w0.254: U1.86 15.12,24.6 14.71,25.02 8.87,25.02 8.61,25.27 8.61,30.61 8.87,30.86 8.87,32.13 9.5,32.77 10.39,32.77 10.64,33.02 10.64,34.16 9.72,35.09 9.72,36.32 9.37,36.66 v1(9.37,37.21)
  Inner1 w0.254: v1(9.37,37.21) 8.61,37.21 6.96,38.86 3.28,38.86 2.14,40 1.88,40
P21.5: length 28.6
  Top Layer w0.254: U1.87 14.99,24.1 14.58,24.51 8.48,24.51 8.1,24.89 v1(8.1,31.24) 8.1,32 9.72,33.62 9.72,33.66
  Inner1 w0.254: P3.2 1.88,36.96 3.02,35.81 3.02,34.29 3.66,33.66 5.69,33.66 v1(8.1,31.24)
P21.6: length 24.1
  Top Layer w0.254: U1.88 14.85,23.6 14.45,24 7.98,24 7.47,24.51 7.47,31.88 5.69,33.66 5.69,36.07 4.42,37.34 P3.1
P21.7: length 41.8
  Top Layer w0.254: U1.90 19.16,22.6 19.53,22.22 v1(20.68,22.22) ; P3.4 1.63,34.92 0.61,33.91 0.61,24.26 1.37,23.5 3.15,23.5 4.42,22.22
  Inner2 w0.254: v1(20.68,22.22) 20.68,20.83 19.91,20.07 18.39,20.07 15.98,17.65 14.33,17.65 13.31,18.67 13.31,20.45 11.53,22.22 4.42,22.22
P22.0: length 14.7
  Top Layer w0.254: 16.96,30.6 13.18,30.61 12.68,31.11 12.68,36.83 9.5,40
P22.1: length 19.7
  Top Layer w0.254: 16.96,30.1 12.8,30.1 12.17,30.73 12.17,36.7 10.01,38.86 8.87,38.86 8.23,39.5 8.23,41.28 P1.36
P22.2: length 18.5
  Top Layer w0.254: 16.96,29.6 12.54,29.6 11.66,30.48 11.66,36.58 9.88,38.35 7.47,38.35 6.96,38.86 6.96,40
P22.3: length 25.3
  Top Layer w0.254: P1.38 3.15,41.28 3.15,39.5 3.79,38.86 5.69,38.86 6.71,37.85 9.75,37.85 11.15,36.45 11.15,30.35 12.4,29.1 16.96,29.1
P23.1: length 16.5
  Top Layer w0.254: 16.96,31.1 13.56,31.11 13.18,31.5 13.18,36.96 10.77,39.37 10.77,41.28 P1.34
P32.4: length 11
  Top Layer w0.254: 12.04,40 12.04,38.73 13.82,36.96 15.85,36.96 18.91,33.9 U1.72
P33.4: length 7
  Top Layer w0.254: 24.74,40 24.74,37.59 24.87,37.34 24.91,37.25 U1.60
P33.5: length 10.5
  Top Layer w0.254: U1.61 24.41,37.29 23.34,38.35 23.34,41.53 22.33,42.55 P1.24
P33.6: length 7.7
  Top Layer w0.254: U1.62 23.91,37.02 22.2,38.73 22.2,40
P33.7: length 11.6
  Top Layer w0.254: U1.63 23.41,36.89 22.07,38.23 21.19,38.23 20.93,38.48 20.93,41.4 19.79,42.55 P1.26
P33.8: length 9.1
  Top Layer w0.254: U1.64 22.91,36.5 21.69,37.72 20.3,37.72 19.66,38.35 19.66,40
P33.9: length 12.7
  Top Layer w0.254: U1.65 22.41,36.28 21.48,37.21 20.04,37.21 18.39,38.86 18.39,41.66 17.5,42.55 P1.28
P33.10: length 9.8
  Top Layer w0.254: U1.66 21.91,36.03 21.95,36.07 21.31,36.7 19.91,36.7 17.12,39.5 17.12,40
P33.11: length 13
  Top Layer w0.254: U1.67 21.41,34.52 21.44,34.54 17.38,38.61 16.23,38.61 15.85,38.99 15.85,41.15 14.58,42.42 P1.30
P33.12: length 10.8
  Top Layer w0.254: 14.58,40 14.58,38.61 15.09,38.1 17.25,38.1 20.91,34.44 U1.68
P33.13: length 14.8
  Top Layer w0.254: U1.69 20.41,34.15 17.12,37.47 13.95,37.47 13.31,38.1 13.31,40.89 12.04,42.16 P1.32
Q1_4: length 7.5
  Bottom Layer w0.254: Q1.6 17.82,37.02 17.15,36.35 L1.1 17.85,35.12 Q1.4
R3_1: length 11.2
  Top Layer w0.254: v1(8.87,21.46) 8.87,19.8 RST.2 8.8,17.91 v1(6.45,17.91)
  Bottom Layer w0.254: R3.1 7.09,17.27 v1(6.45,17.91) ; C20.2 8.87,22.29 v1(8.87,21.46) 8.87,20.58 R4.2
R16_2: length 1.9
  Top Layer w0.5: POWER.1 42.87,21.5 v1(42.68,21.7)
  Bottom Layer w0.5: R16.2 42.94,21.96 v1(42.68,21.7)
R17_2: length 2
  Top Layer w0.254: 8.02,36.32 7.98,36.32 v1(7.22,37.08)
  Bottom Layer w0.254: v1(7.22,37.08) 6.72,37.58 R17.2
R18_2: length 3
  Top Layer w0.254: 8.02,33.66 8.02,34.63 v1(7.34,35.31)
  Bottom Layer w0.254: v1(7.34,35.31) 7.34,35.44 R18.2
R19_2: length 2.3
  Top Layer w0.254: v1(6.96,11.3) 8.02,11.3
  Bottom Layer w0.254: v1(6.96,11.3) 7.99,11.3 R19.2
R20_2: length 2
  Top Layer w0.254: v1(7.09,8.13) LED4.1
  Bottom Layer w0.254: R20.2 v1(7.09,8.13)
RST: length 20.4
  Top Layer w0.254: U1.97 14.25,19.1 v1(14.07,18.92)
  Bottom Layer w0.254: v1(14.07,18.92) 13.31,18.92 12.55,18.16 7.98,18.16 7.6,18.54 5.44,18.54 4.42,17.53 4.42,17.14 5.06,16.51 9.63,16.51 R3.2
TCK: length 19.6
  Top Layer w0.254: v1(19.28,21.34) 18.14,21.34 17.87,21.6 U1.92
  Inner1 w0.254: DM.4 6.58,22.61 15.6,22.61 15.85,22.86 18.9,22.86 19.28,22.48 v1(19.28,21.34)
TMS: length 19.8
  Top Layer w0.254: v1(19.66,23.11) 16.97,23.11 U1.89
  Inner1 w0.254: v1(19.66,23.11) 19.66,23.37 16.49,23.37 15.85,24 7.72,24 DM.2
TRST: length 22.1
  Top Layer w0.254: v1(18.65,21.97) 18.51,22.1 U1.91
  Inner1 w0.254: v1(18.65,21.97) 18.65,22.1 6.83,22.1 DM.8
  Bottom Layer w0.254: DM.8 4.8,19.3 8.87,19.3 R13.1
VAGND: length 4.6
  Top Layer w0.254: v1(34.77,30.68) 34.41,31.03 U1.41
  Bottom Layer w0.254: C4.1 v1(34.77,30.68) R2.1
VAREF: length 8
  Top Layer w0.254: U1.42 33.91,31.02 v1(32.87,29.97)
  Bottom Layer w0.254: C4.2 33.57,29.27 v1(32.87,29.97) 32.87,31.11 33.83,32.08 33.83,32.77
VGATE1N: length 15.7
  Top Layer w0.254: v1(19.91,31.75) U1.70
  Bottom Layer w0.254: v1(19.91,31.75) 20.93,32.77 25.38,32.77 26.52,33.91 26.52,36.06 25.56,37.02 22.2,37.02
VGATE1P: length 7.7
  Top Layer w0.254: v1(18.52,31.5) 18.9,31.88 19.15,31.88 19.41,32.14 U1.71
  Bottom Layer w0.254: Q1.3 21.38,35.12 18.52,32.26 v1(18.52,31.5)
XTAL1: length 5.2
  Top Layer w0.254: U1.81 15.27,27.1 v1(15.22,27.05)
  Bottom Layer w0.254: C18.2 14.01,26.9 Y2.1 14.92,26.75 v1(15.22,27.05)
XTAL2: length 12
  Top Layer w0.254: U1.82 15.91,26.6 v1(15.47,26.16)
  Bottom Layer w0.254: Y2.3 12.61,24.4 C19.2 ; v1(15.47,26.16) 15.47,21.84 14.84,21.21 13.56,21.21 12.61,22.16 12.61,22.35

## Copper pours and planes (outline as drawn; the poured copper is in the pictures)
GNDCORE on Top Layer: -4.12,47.5 -4.12,-1 -1.52,-3.6 56.58,-3.6 56.88,-3.9 56.88,46 56.18,46.7 -2.52,46.7 -3.52,47.7
GNDCORE on Bottom Layer: -1.92,45.5 -1.92,-1.1 -1.62,-1.4 52.18,-1.4 53.78,0.2 53.78,44.5 52.68,45.6 -1.22,45.6 -1.82,45
GNDCORE on Inner1: 59.98,-2.1 56.48,-5.6 -2.02,-5.6 -6.72,-0.9 -6.72,48.5 -5.82,47.6 59.58,47.6 59.98,47.2
VCC3V3 on Inner2: -8.02,49.5 -8.02,-3.9 -7.52,-4.4 61.98,-4.4 62.98,-3.4 62.98,48.2 61.28,49.9 -7.62,49.9
P00.4 on Bottom Layer: 11.53,29.72 11.53,21.72 11.79,21.46 15.09,21.46 15.34,21.72 15.34,25.78 15.6,25.78 16.23,26.42 17.88,26.42 17.88,27.31 16.36,27.31 16.23,27.43 16.23,28.19 14.71,29.72

Small or netless copper shapes (teardrops, artwork), in the pictures only: 1 on Inner2

## Text on the board
Bottom Silkscreen Layer: GND
Top Silkscreen Layer: AN25 | AN36 | AN38 | AN44 | AN46 | AN48 | 00.12 | 00.8 | 00.9 | AN49 | AN45 | AN47 | AN35 | AN37 | AN39 | AN24 | TRST | VCC | GND | 20.2 | 20.3 | 21.4 | 21.5 | 20.9 | 20.11 | 20.13 | 20.14 | 15.0 | 21.7 | 21.3 | 15.1 | 20.12 | 22.3 | 20.8 | 20.10 | 15.2 | 21.2 | 21.6 | 20.0 | 15.4 | 15.3 | 22.1 | 22.2 | 22.0 | 15.5 | 23.1 | 15.6 | 20.7 | ESR1 | 20.6 | ESR0 | 33.13 | 32.4 | 15.7 | 15.8 | 33.11 | 14.1 | 33.12 | 14.0 | 33.9 | 33.10 | 14.2 | 14.3 | 14.5 | 33.7 | 33.8 | 14.4 | 33.5 | 33.6 | 14.6 | 13.0 | A0 | 33.4 | 13.1 | 13.2 | 11.2 | 13.3 | A2 | A1 | 11.6 | A4 | A3 | 11.3 | A6 | A5 | 11.10 | 11.9 | A8 | 11.11 | A7 | 11.12 | 10.1 | 10.2 | A10 | A11 | 10.4 | A13 | 10.3 | A12 | A16 | A17 | 02.0 | 10.6 | 02.2 | 02.1 | A21 | A20 | 00.4 | 02.7 | 00.2 | 00.6 | 00.0 | 02.3 | 02.4 | 00.3 | 00.1 | 02.6 | 00.7 | 00.5 | 02.5 | 02.8 | TX | RX | 3V3 | RST | TCK | TDD | TMS | TC264D
